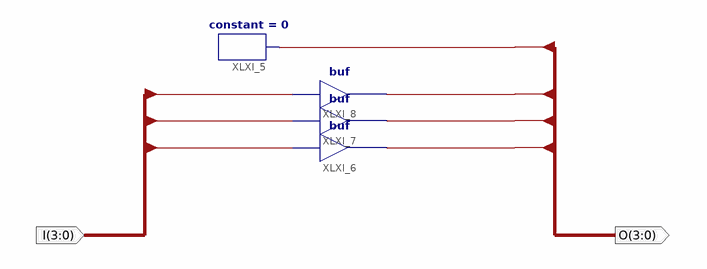
[diagram p0: schematic sheet 1]
// Xilinx ISE schematic Right_Shift.sch (virtex6) as structural Verilog: 4 symbols, 2 ports
module Right_Shift (
  input  [3:0] I,
  output [3:0] O
);

  constant #(.CValue("0")) XLXI_5 (.O(O[3]));
  buf XLXI_6 (O[2], I[3]);
  buf XLXI_7 (O[1], I[2]);
  buf XLXI_8 (O[0], I[1]);
endmodule
